# Altium schematic sheet 04_Connector.SchDoc
size A4; SheetNumber: 4; SheetTotal: 4
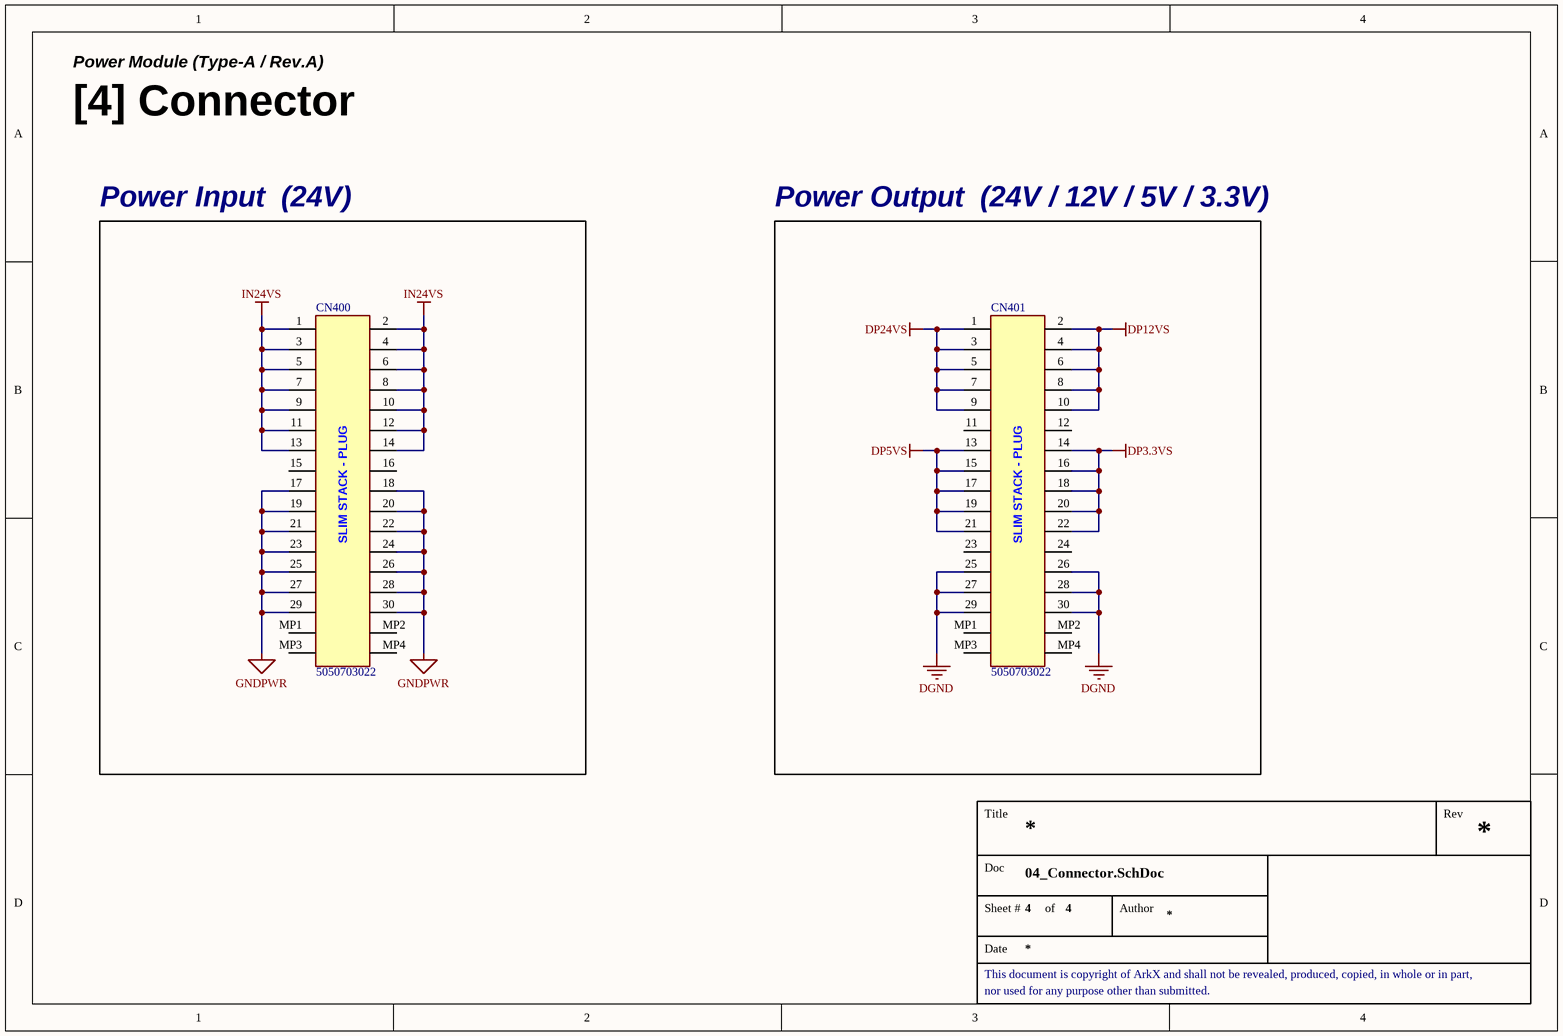
[diagram p0: 04_Connector.SchDoc]

## Parts
CN400  5050703022  [CON_SLIM-STACK_PLUG-30P]
CN401  5050703022  [CON_SLIM-STACK_PLUG-30P]

## Blocks framed on the sheet
Power Input  (24V): CN400
Power Output  (24V / 12V / 5V / 3.3V): CN401

## Nets
DGND: CN401.25 CN401.26 CN401.27 CN401.28 CN401.29 CN401.30
DP3.3VS: CN401.14 CN401.16 CN401.18 CN401.20 CN401.22
DP5VS: CN401.13 CN401.15 CN401.17 CN401.19 CN401.21
DP12VS: CN401.2 CN401.4 CN401.6 CN401.8 CN401.10
DP24VS: CN401.1 CN401.3 CN401.5 CN401.7 CN401.9
GNDPWR: CN400.17 CN400.18 CN400.19 CN400.20 CN400.21 CN400.22 CN400.23 CN400.24 CN400.25 CN400.26 CN400.27 CN400.28 CN400.29 CN400.30
IN24VS: CN400.1 CN400.2 CN400.3 CN400.4 CN400.5 CN400.6 CN400.7 CN400.8 CN400.9 CN400.10 CN400.11 CN400.12 CN400.13 CN400.14

Not connected (* = marked no-connect by the designer): CN400 15 16 MP1 MP2 MP3 MP4; CN401 11 12 23 24 MP1 MP2 MP3 MP4

## Notes on the sheet
- Power Module (Type-A / Rev.A)
- [4] Connector
- Title
- Rev
- Doc
- Sheet #
- of
- Author
- This document is copyright of ArkX and shall not be revealed, produced, copied, in whole or in part,
- Date
- nor used for any purpose other than submitted.
- (in symbol CON_SLIM-STACK_PLUG-30P) SLIM STACK - PLUG

## Library data of the parts
CN400 CN401 = CON_SLIM-STACK_PLUG-30P: 30 Position Connector Plug, Outer Shroud Contacts Surface Mount Gold; LCSC Part #: None; JLCPCB Part Type: None